# EAGLE design zigbit_usbstick (EAGLE 5.09)
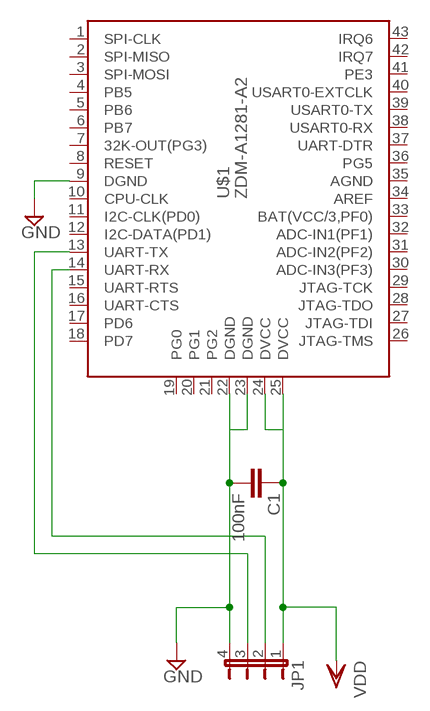
[diagram p0: schematic, sheet 1]

## Parts
C1  100nF  C-EUC0805K  [C0805K]
JP1  JP4E  [JP4]
U$1  ZDM-A1281-A2  [ZIGBITA2]

## Nets
GND: C1.2 JP1.4 U$1.9(DGND) U$1.22(DGND) U$1.23(DGND)
N$1: JP1.3 U$1.13(UART-TX)
N$2: JP1.2 U$1.14(UART-RX)
VDD: C1.1 JP1.1 U$1.24(DVCC) U$1.25(DVCC)
Unconnected: U$1.1(SPI-CLK) U$1.2(SPI-MISO) U$1.3(SPI-MOSI) U$1.4(PB5) U$1.5(PB6) U$1.6(PB7) U$1.7(32K-OUT(PG3)) U$1.8(RESET) U$1.10(CPU-CLK) U$1.11(I2C-CLK(PD0)) U$1.12(I2C-DATA(PD1)) U$1.15(UART-RTS) U$1.16(UART-CTS) U$1.17(PD6) U$1.18(PD7) U$1.19(PG0) U$1.20(PG1) U$1.21(PG2) U$1.26(JTAG-TMS) U$1.27(JTAG-TDI) U$1.28(JTAG-TDO) U$1.29(JTAG-TCK) U$1.30(ADC-IN3(PF3)) U$1.31(ADC-IN2(PF2)) U$1.32(ADC-IN1(PF1)) U$1.33(BAT(VCC/3,PF0)) U$1.34(AREF) U$1.35(AGND) U$1.36(PG5) U$1.37(UART-DTR) U$1.38(USART0-RX) U$1.39(USART0-TX) U$1.40(USART0-EXTCLK) U$1.41(PE3) U$1.42(IRQ7) U$1.43(IRQ6)

## Library data of the parts
C1 = resistor:C-EU: CAPACITOR, European symbol
JP1 = jumper:JP4E: JUMPER
U$1 = atmel:ZDM-A1281-A2

## Board
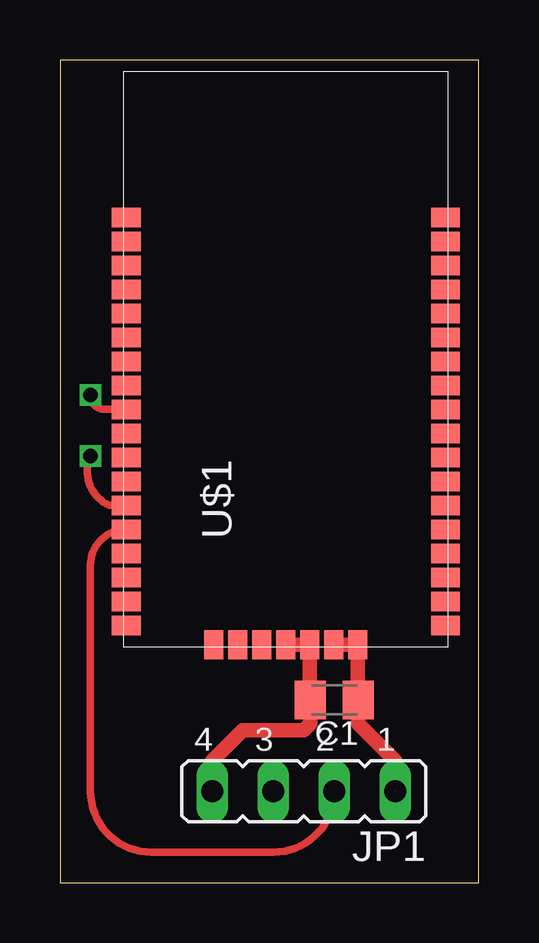
[diagram p1: board, top side]
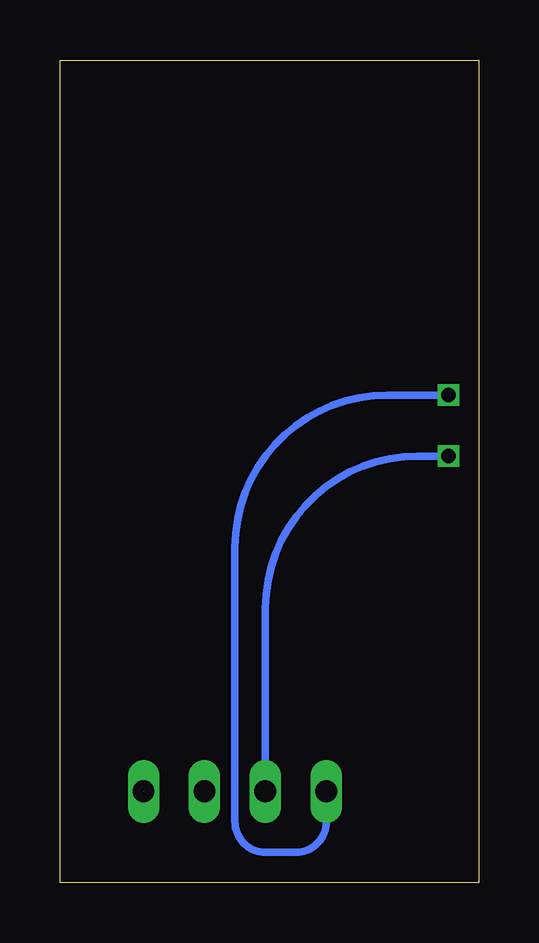
[diagram p2: board, bottom side, seen from below]

Size 17.45 x 34.28 mm. Coordinates in mm from the lower left corner, seen from the top.
Outline: 0,0 17.45,0 17.45,34.28 0,34.28 0,0
Copper layers (1*16): Top 0.035mm / dielectric 1.5mm / Bottom 0.035mm
Design rules "PCB-POOL Standard": minimum track width 0.15mm, minimum drill 0.3mm, track to track 0.15mm, track to pad 0.15mm, pad to pad 0.15mm, via to via 0.15mm, smd to smd 0.15mm, copper to edge 0.3mm, drill to drill 0.2mm, minimum pad ring 0.2mm, minimum via ring 0.15mm, stop-mask expansion 0.075mm, vias tented up to drill 0mil, thermal gap 0.2mm

### Footprints (pad centres in the part's own frame; a part is rotated, then mirrored left to right if it is on the bottom)
C0805K = smd 1.3 x 1.6: 1 -1,0; 2 1,0
JP4 = drill 0.914 long: 1 -3.81,0; 2 -1.27,0; 3 1.27,0; 4 3.81,0
ZIGBITA2 = smd 0.8 x 1.2: 1 7.4,7.4; 2 6.4,7.4; 3 5.4,7.4; 4 4.4,7.4; 5 3.4,7.4; 6 2.4,7.4; 7 1.4,7.4; 8 0.4,7.4; 9 -0.6,7.4; 10 -1.6,7.4; 11 -2.6,7.4; 12 -3.6,7.4; 13 -4.6,7.4; 14 -5.6,7.4; 15 -6.6,7.4; 16 -7.6,7.4; 17 -8.6,7.4; 18 -9.6,7.4; 26 -9.6,-5.9; 27 -8.6,-5.9; 28 -7.6,-5.9; 29 -6.6,-5.9; 30 -5.6,-5.9; 31 -4.6,-5.9; 32 -3.6,-5.9; 33 -2.6,-5.9; 34 -1.6,-5.9; 35 -0.6,-5.9; 36 0.4,-5.9; 37 1.4,-5.9; 38 2.4,-5.9; 39 3.4,-5.9; 40 4.4,-5.9; 41 5.4,-5.9; 42 6.4,-5.9; 43 7.4,-5.9 | smd 1.2 x 0.8: 19 -10.4,3.75; 20 -10.4,2.75; 21 -10.4,1.75; 22 -10.4,0.75; 23 -10.4,-0.25; 24 -10.4,-1.25; 25 -10.4,-2.25

### Placement (x,y rotation side)
C1  11.43,7.62 180 top
JP1  10.16,3.81 180 top
U$1  10.16,20.32 90 top

### Tracks (layer width: path | path; a pad name or v marks a point on that pad's centre or on a via)
GND  (via drill 0.6)
  Top 0.305: U$1.9 1.87,19.72 arc-90 v1.27,20.32
  Top 0.61: U$1.22 U$1.23 10.41,7.64 C1.2 10.43,6.62 10.16,6.35 7.62,6.35 6.35,5.08 JP1.4
  Bottom 0.305: v1.27,20.32 3.81,20.32 arc-90 10.16,13.97 10.16,2.54 arc-90 8.89,1.27 7.62,1.27 arc-90 6.35,2.54 JP1.4
N$1  (via drill 0.6)
  Top 0.305: U$1.13 2.06,15.72 arc-90 v1.27,17.78
  Bottom 0.305: JP1.3 8.89,11.43 arc90 2.54,17.78 v1.27,17.78
N$2
  Top 0.305: U$1.14 arc90 1.27,13.23 1.27,3.81 arc90 3.81,1.27 8.89,1.27 arc90 JP1.2
VDD  (1 unrouted)
  Top 0.61: U$1.24 U$1.25 12.41,7.64 C1.1 12.43,6.62 13.97,5.08 JP1.1